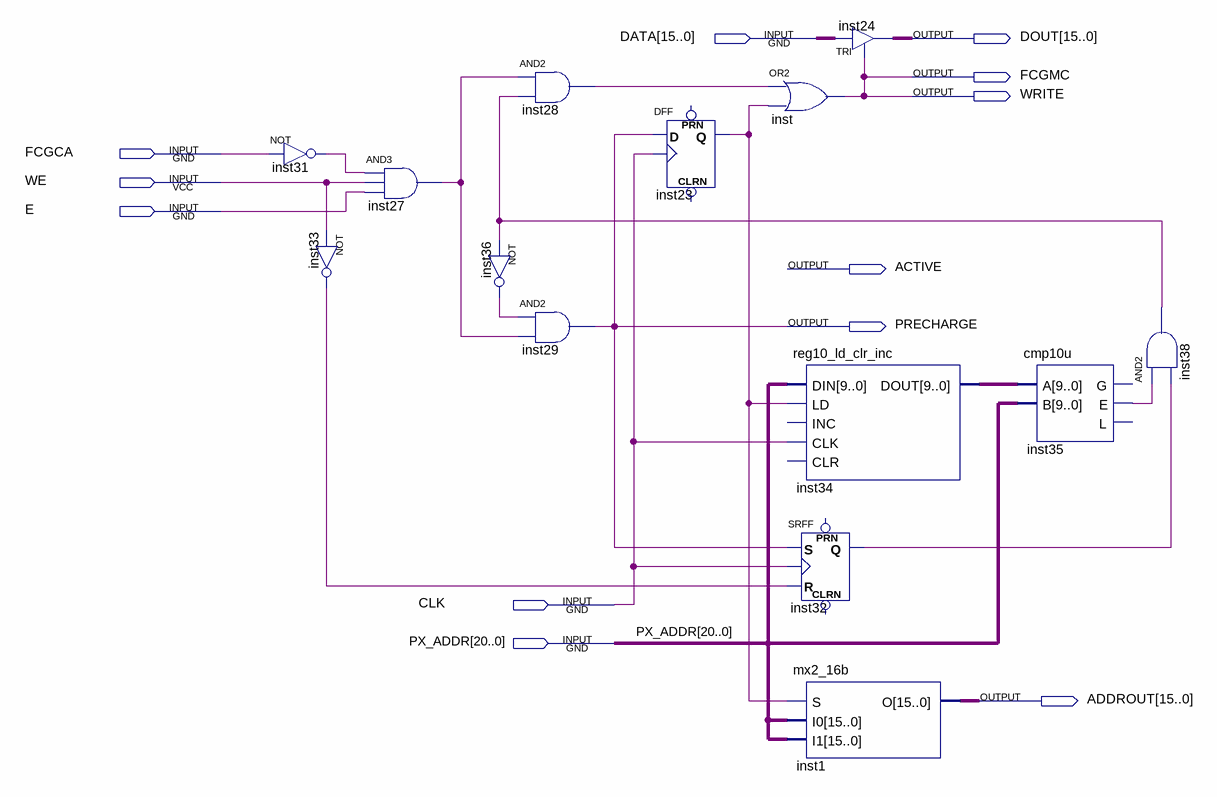
[diagram p0: schematic sheet]
// Quartus schematic wtcb.bdf as structural Verilog: 14 symbols, 12 pins
module wtcb (
  input  [15:0] DATA,
  input  FCGCA,
  input  WE,
  input  E,
  input  CLK,
  input  [20:0] PX_ADDR,
  output [15:0] DOUT,
  output FCGMC,
  output WRITE,
  output ACTIVE,
  output PRECHARGE,
  output [15:0] ADDROUT
);

  wire inst23_q, inst27_out, inst28_out, inst31_out, inst32_q, inst33_out, inst35_e, inst36_out, inst38_out;
  wire [9:0] inst34_dout;

  not inst31 (inst31_out, FCGCA);
  and inst27 (inst27_out, inst31_out, WE, E);
  not inst33 (inst33_out, WE);
  and inst28 (inst28_out, inst27_out, inst38_out);
  not inst36 (inst36_out, inst38_out);
  and inst29 (PRECHARGE, inst36_out, inst27_out);
  DFF inst23 (.CLK(CLK), .D(PRECHARGE), .Q(inst23_q));  // open: CLRN, PRN
  or inst (FCGMC, inst28_out, inst23_q);
  reg10_ld_clr_inc inst34 (.DIN(PX_ADDR[20:11]), .LD(inst23_q), .CLK(CLK), .DOUT(inst34_dout));  // open: INC, CLR
  SRFF inst32 (.S(PRECHARGE), .R(inst33_out), .CLK(CLK), .Q(inst32_q));  // open: PRN, CLRN
  mx2_16b inst1 (.S(inst23_q), .I0(PX_ADDR), .I1(PX_ADDR), .O(ADDROUT));
  TRI inst24[15:0] (.IN(DATA), .OE(FCGMC), .OUT(DOUT));
  cmp10u inst35 (.A(inst34_dout), .B(PX_ADDR[20:11]), .E(inst35_e));  // open: G, L
  and inst38 (inst38_out, inst35_e, inst32_q);

  assign WRITE = FCGMC;
endmodule
